# Altium project DoubleSerial.PrjPcb
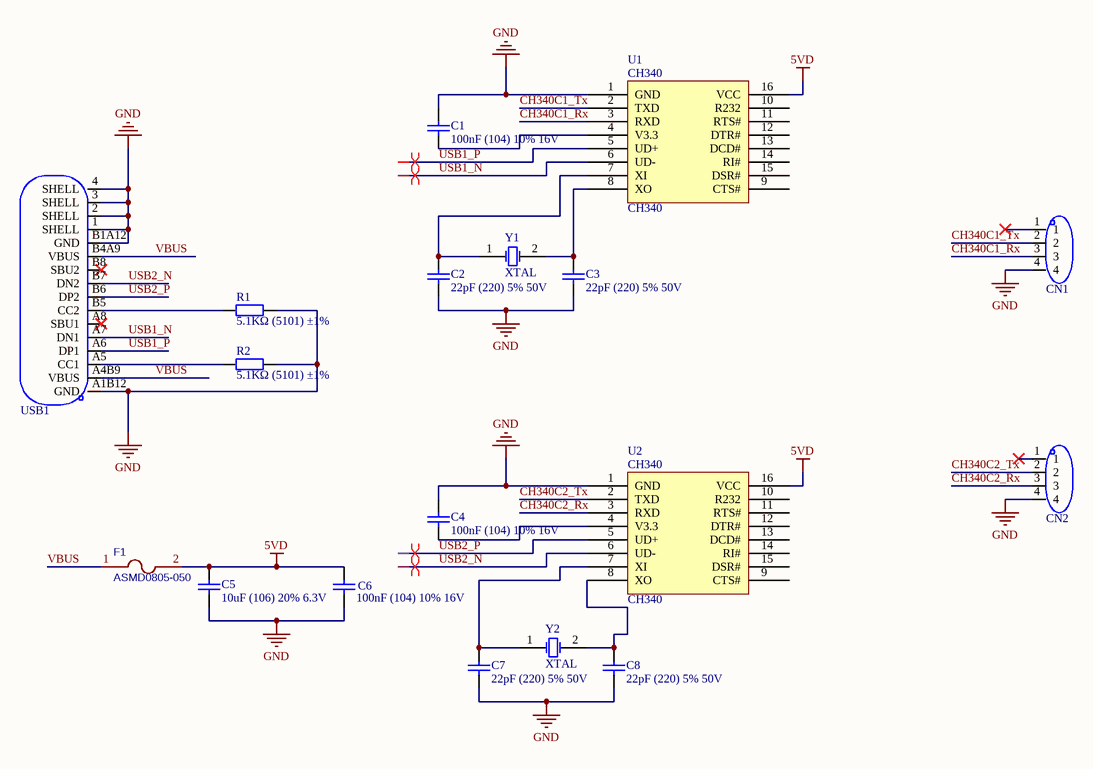
[diagram p0: Main.SchDoc]
1 sheet, 18 parts. Net scope: global (net labels, ports and power ports of the same name join across sheets).
Board file: DoubleSerial.PcbDoc

## Sheet Main.SchDoc
size A4; SheetNumber: 1; SheetTotal: 1

### Parts
C1  100nF (104) 10% 16V  [0402_C]
C2  22pF (220) 5% 50V  [0402_C]
C3  22pF (220) 5% 50V  [0402_C]
C4  100nF (104) 10% 16V  [0402_C]
C5  10uF (106) 20% 6.3V  [0402_C]
C6  100nF (104) 10% 16V  [0402_C]
C7  22pF (220) 5% 50V  [0402_C]
C8  22pF (220) 5% 50V  [0402_C]
CN1  1.5-4A  [CONN-TH_1.5-4A]  (value not drawn)
CN2  1.5-4A  [CONN-TH_1.5-4A]  (value not drawn)
F1  ASMD0805-050  [ASMD0805]
R1  5.1KΩ (5101) ±1%  [0402_R]
R2  5.1KΩ (5101) ±1%  [0402_R]
U1  CH340  [SOP-16_L10.0]
U2  CH340  [SOP-16_L10.0]
USB1  TYPE-C16PIN  [TYPE-C-SMD]  (value not drawn)
Y1  XTAL  [XTAL_socket]
Y2  XTAL  [XTAL_socket]

### Nets
5VD: C5.2 C6.2 F1.2 U1.16(VCC) U2.16(VCC)
GND: C1.2 C2.1 C3.1 C4.2 C5.1 C6.1 C7.1 C8.1 CN1.4 CN2.4 R1.2 R2.2 U1.1(GND) U2.1(GND) USB1.1(SHELL) USB1.2(SHELL) USB1.3(SHELL) USB1.4(SHELL) USB1.A1B12(GND) USB1.B1A12(GND)
CH340C1_Rx: CN1.3 U1.3(RXD)
CH340C1_Tx: CN1.2 U1.2(TXD)
CH340C2_Rx: CN2.3 U2.3(RXD)
CH340C2_Tx: CN2.2 U2.2(TXD)
USB1_N: U1.6(UD-) USB1.A7(DN1)
USB1_P: U1.5(UD+) USB1.A6(DP1)
USB2_N: U2.6(UD-) USB1.B7(DN2)
USB2_P: U2.5(UD+) USB1.B6(DP2)
VBUS: F1.1 USB1.A4B9(VBUS) USB1.B4A9(VBUS)
NetC1_1: C1.1 U1.4(V3.3)
NetC2_2: C2.2 U1.7(XI) Y1.1(OSC1)
NetC3_2: C3.2 U1.8(XO) Y1.2(OSC2)
NetC4_1: C4.1 U2.4(V3.3)
NetC7_2: C7.2 U2.7(XI) Y2.1(OSC1)
NetC8_2: C8.2 U2.8(XO) Y2.2(OSC2)
NetR1_1: R1.1 USB1.B5(CC2)
NetR2_1: R2.1 USB1.A5(CC1)

Not connected (* = marked no-connect by the designer): CN1 1*; CN2 1*; U1 9(CTS#) 10(R232) 11(RTS#) 12(DTR#) 13(DCD#) 14(RI#) 15(DSR#); U2 9(CTS#) 10(R232) 11(RTS#) 12(DTR#) 13(DCD#) 14(RI#) 15(DSR#); USB1 A8(SBU1)* B8(SBU2)*

### Layout directives
differential pair: USB1_N, USB1_P, USB2_N, USB2_P

### Library data of the parts
C1 C4 C6 = 0402 100nF (104) 10% 16V: 贴片电容; ComponentLink1Description: 供应商链接; ComponentLink1URL: http://www.szlcsc.com/product/details_1877.html; Package: 0402; Supplier: LC; SuppliersPartNumber: C1525
C2 C3 C7 C8 = 0402 22pF (220) 5% 50V: 贴片电容; ComponentLink1Description: 供应商链接; ComponentLink1URL: http://www.szlcsc.com/product/details_1907.html; Package: 0402; Supplier: LC; SuppliersPartNumber: C1555
C5 = 0402 10uF (106) 20% 6.3V: 贴片电容; ComponentLink1Description: 供应商链接; ComponentLink1URL: http://www.szlcsc.com/product/details_16204.html; Package: 0402; Supplier: LC; SuppliersPartNumber: C15525
CN1 CN2 = 1.5-4A: Manufacturer: CAX(创都); Symbol: 1.5-4A_C722668; Add into BOM: yes; Reference Series: ZH; Pitch: 1.5mm; Pins Structure: 1x4P; Number of PINs Per Row: 4; Gender: 公型插针; Current Rating (Max): 1A; Device: 1.5-4A; LCSC Part Name: 1.5-4A; Supplier Part: C722668; Manufacturer Part: 1.5-4A; Supplier Footprint: 插件,P=1.5mm; JLCPCB Part Class: Extended Part; Datasheet: https://atta.szlcsc.com/upload/public/pdf/source/20200907/C722655_2C388E20D41359457DA4667FBF76842B.pdf; Supplier: LCSC; Convert to PCB: yes; Number of Rows: 1; Row Spacing: -; Mounting Style: 直插; Operating Temperature Range: -25~+85
F1 = ASMD0805-050: BOM_Manufacturer: JDTFUSE; Contributor: LCSC; BOM_Supplier: LCSC; BOM_Manufacturer Part: ASMD0805-050; BOM_Supplier Part: C135329; BOM_JLCPCB Part Class: Extended Part; spicePre: F; spiceSymbolName: ASMD0805-050
R1 R2 = 0402 5.1KΩ (5101) 1%: 贴片电阻; ComponentLink1Description: 供应商链接; ComponentLink1URL: http://www.szlcsc.com/product/details_26648.html; Package: 0402; Supplier: LC; SuppliersPartNumber: C25905
U1 U2 = CH340: USB to serial; ComponentLink1Description: 供应商链接; ComponentLink1URL: http://www.szlcsc.com/product/details_14927.html; Package: SOIC-16_150mil; Supplier: LC; SuppliersPartNumber: C14267
USB1 = TYPE-C16PIN: Manufacturer: SHOU HAN(首韩); Add into BOM: yes; Connector Type: Type-C; Gender: 母座; Number of Contacts: 16; Number of Ports: 1; Current Rating - Power (Max): 3A; Symbol: TYPE-C16PIN; Device: TYPE-C16PIN; LCSC Part Name: Type-C 母座 卧贴 快充闪充 停产; Supplier Part: C393939; Manufacturer Part: TYPE-C16PIN; Supplier Footprint: SMD; JLCPCB Part Class: Extended Part; Datasheet: https://atta.szlcsc.com/upload/public/pdf/source/20190521/C393939_7B9043D4CF1026AF443AB60D91FBCD5C.pdf; Supplier: LCSC; Convert to PCB: yes; Standard: -; Mounting Style: 卧贴; Operating Temperature Range: -40~+85
Y1 Y2 = XTAL: Crystal Oscillator; Published: 8-Jun-2000; LatestRevisionDate: 17-Jul-2002; LatestRevisionNote: Re-released for DXP Platform.; PackageReference: R38; Publisher: Altium Limited; PackageDescription: Crystal, Thru-Hole; 2 Leads; Body 3.1 x 8.2 mm (Dia.xH)